# EAGLE design quadrant_tia (EAGLE 6.5.0)
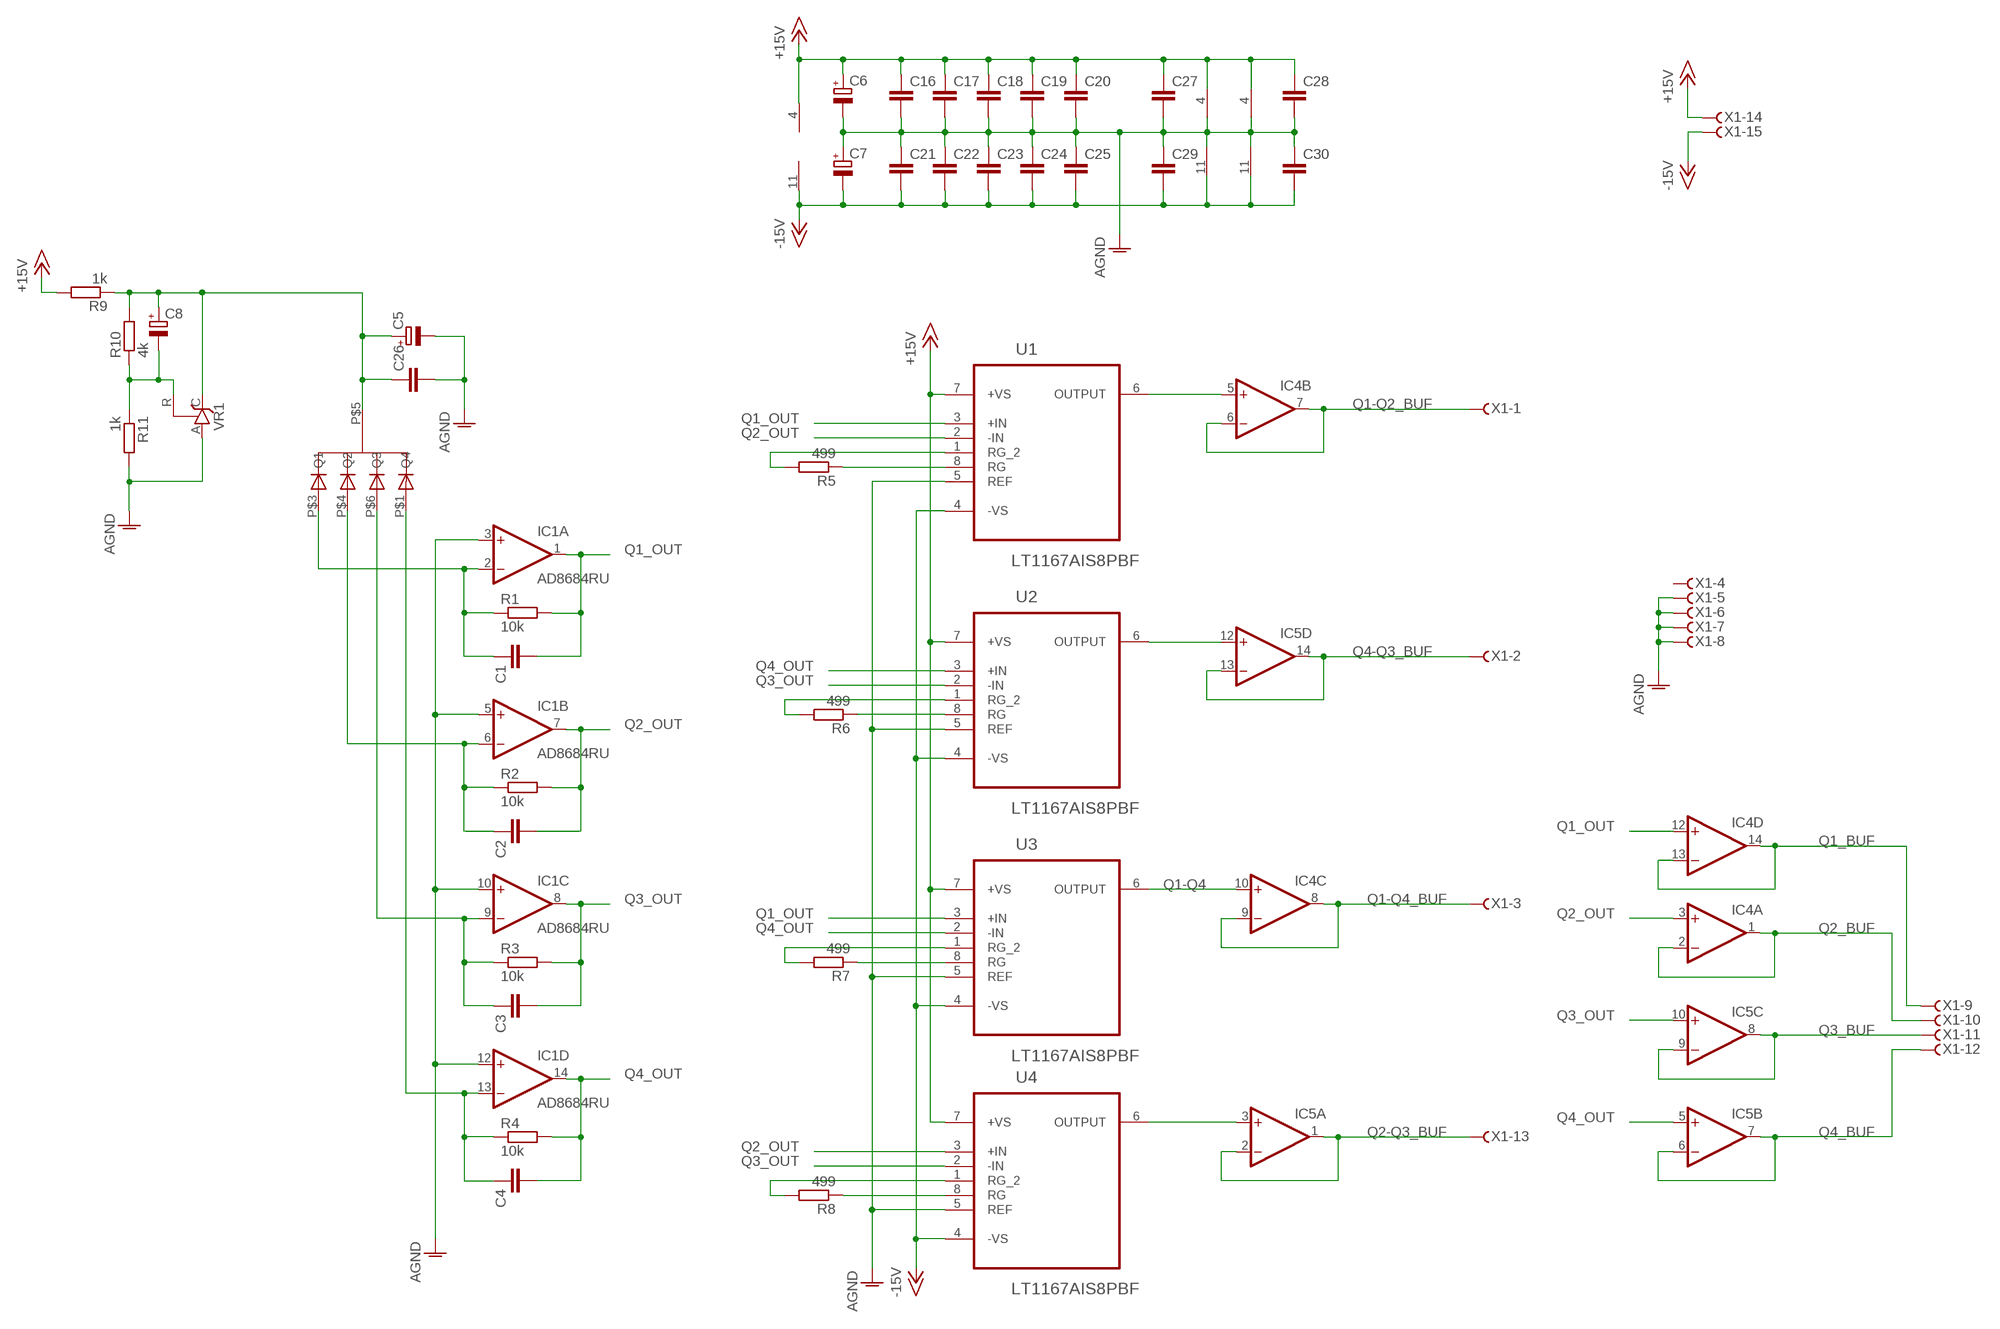
[diagram p0: schematic, sheet 1]

## Parts
C1  C-EUC0805K  [C0805K]
C2  C-EUC0805K  [C0805K]
C3  C-EUC0805K  [C0805K]
C4  C-EUC0805K  [C0805K]
C5  CPOL-EUE5-8.5  [E5-8,5]
C6  CPOL-EUE5-8.5  [E5-8,5]
C7  CPOL-EUE5-8.5  [E5-8,5]
C8  CPOL-EUE5-8.5  [E5-8,5]
C16  C-EUC0805K  [C0805K]
C17  C-EUC0805K  [C0805K]
C18  C-EUC0805K  [C0805K]
C19  C-EUC0805K  [C0805K]
C20  C-EUC0805K  [C0805K]
C21  C-EUC0805K  [C0805K]
C22  C-EUC0805K  [C0805K]
C23  C-EUC0805K  [C0805K]
C24  C-EUC0805K  [C0805K]
C25  C-EUC0805K  [C0805K]
C26  C-EUC0805K  [C0805K]
C27  C-EUC0805K  [C0805K]
C28  C-EUC0805K  [C0805K]
C29  C-EUC0805K  [C0805K]
C30  C-EUC0805K  [C0805K]
IC1  AD8684RU  [TSSOP14]
IC4  4AMP_P4+11D  [SO14]
IC5  4AMP_P4+11D  [SO14]
R1  10k  R-EU_M1206  [M1206]
R2  10k  R-EU_M1206  [M1206]
R3  10k  R-EU_M1206  [M1206]
R4  10k  R-EU_M1206  [M1206]
R5  499  R-EU_M1206  [M1206]
R6  499  R-EU_M1206  [M1206]
R7  499  R-EU_M1206  [M1206]
R8  499  R-EU_M1206  [M1206]
R9  1k  R-EU_R0805  [R0805]
R10  4k  R-EU_R0805  [R0805]
R11  1k  R-EU_R0805  [R0805]
U1  LT1167AIS8PBF  [SOIC127P600X175-8N]
U2  LT1167AIS8PBF  [SOIC127P600X175-8N]
U3  LT1167AIS8PBF  [SOIC127P600X175-8N]
U4  LT1167AIS8PBF  [SOIC127P600X175-8N]
U$1  QP50-6  [TO-HUGE]
VR1  TL431CLP  [TO92-CLP]
X1  F15HDHS  [HDF15H]

## Nets
+15V: C6.+ C16.1 C17.1 C18.1 C19.1 C20.1 C27.1 C28.1 IC1.4(P:V+) IC4.4(P:V+) IC5.4(P:V+) R9.2 U1.7(+VS) U2.7(+VS) U3.7(+VS) U4.7(+VS) X1.14
-15V: C7.- C21.2 C22.2 C23.2 C24.2 C25.2 C29.2 C30.2 IC1.11(P:V-) IC4.11(P:V-) IC5.11(P:V-) U1.4(-VS) U2.4(-VS) U3.4(-VS) U4.4(-VS) X1.15
AGND: C5.- C6.- C7.+ C16.2 C17.2 C18.2 C19.2 C20.2 C21.1 C22.1 C23.1 C24.1 C25.1 C26.2 C27.2 C28.2 C29.1 C30.1 IC1.3(A:+IN) IC1.5(B:+IN) IC1.10(C:+IN) IC1.12(D:+IN) R11.2 U1.5(REF) U2.5(REF) U3.5(REF) U4.5(REF) VR1.A X1.5 X1.6 X1.7 X1.8
N$1: C1.1 IC1.2(A:-IN) R1.1 U$1.P$3(Q1)
N$2: R7.1 U3.8(RG)
N$3: R7.2 U3.1(RG_2)
N$4: C2.1 IC1.6(B:-IN) R2.1 U$1.P$4(Q2)
N$5: R6.1 U2.8(RG)
N$6: C3.1 IC1.9(C:-IN) R3.1 U$1.P$6(Q3)
N$7: R6.2 U2.1(RG_2)
N$8: C4.1 IC1.13(D:-IN) R4.1 U$1.P$1(Q4)
N$9: R5.2 U1.1(RG_2)
N$10: R5.1 U1.8(RG)
N$11: R8.2 U4.1(RG_2)
N$12: R8.1 U4.8(RG)
N$13: IC4.5(B:+IN) U1.6(OUTPUT)
N$14: IC5.3(A:+IN) U4.6(OUTPUT)
N$15: IC5.12(D:+IN) U2.6(OUTPUT)
N$16: C5.+ C8.+ C26.1 R9.1 R10.2 U$1.P$5(C) VR1.C
N$17: C8.- R10.1 R11.1 VR1.R
Q1-Q2_BUF: IC4.6(B:-IN) IC4.7(B:OUT) X1.1
Q1-Q4: IC4.10(C:+IN) U3.6(OUTPUT)
Q1-Q4_BUF: IC4.8(C:OUT) IC4.9(C:-IN) X1.3
Q1_BUF: IC4.13(D:-IN) IC4.14(D:OUT) X1.9
Q1_OUT: C1.2 IC1.1(A:OUT) IC4.12(D:+IN) R1.2 U1.3(+IN) U3.3(+IN)
Q2-Q3_BUF: IC5.1(A:OUT) IC5.2(A:-IN) X1.13
Q2_BUF: IC4.1(A:OUT) IC4.2(A:-IN) X1.10
Q2_OUT: C2.2 IC1.7(B:OUT) IC4.3(A:+IN) R2.2 U1.2(-IN) U4.3(+IN)
Q3_BUF: IC5.8(C:OUT) IC5.9(C:-IN) X1.11
Q3_OUT: C3.2 IC1.8(C:OUT) IC5.10(C:+IN) R3.2 U2.2(-IN) U4.2(-IN)
Q4-Q3_BUF: IC5.13(D:-IN) IC5.14(D:OUT) X1.2
Q4_BUF: IC5.6(B:-IN) IC5.7(B:OUT) X1.12
Q4_OUT: C4.2 IC1.14(D:OUT) IC5.5(B:+IN) R4.2 U2.3(+IN) U3.2(-IN)
Unconnected: X1.4

## Library data of the parts
C1-C4 C16-C30 = resistor:C-EU: CAPACITOR, European symbol
C5-C8 = resistor:CPOL-EU: POLARIZED CAPACITOR, European symbol
IC1 = linear:AD8684: Quad Low Power, High Speed JFET Operational Amplifiers Source: http://www.analog.com/UploadedFiles/Data_Sheets/AD8682_8684.pdf
IC4 IC5 = linear:4AMP_P4+11: OP AMP
R1-R11 = resistor:R-EU_: RESISTOR, European symbol
U1-U4 = LT1167:LT1167AIS8PBF: Single Resistor Gain Programmable, Precision Instrumentation Amplifier; MPN: LT1167AIS8#PBF; OC_FARNELL: 1663385; OC_NEWARK: 57M2299; PACKAGE: SOIC-8; SUPPLIER: Linear Technology
U$1 = QP50-6:QP50-6
VR1 = v-reg:TL431CLP: VOLTAGE REGULATOR
X1 = con-subd:F15?S: SUB-D; OC_FARNELL: unknown; OC_NEWARK: unknown

## Board
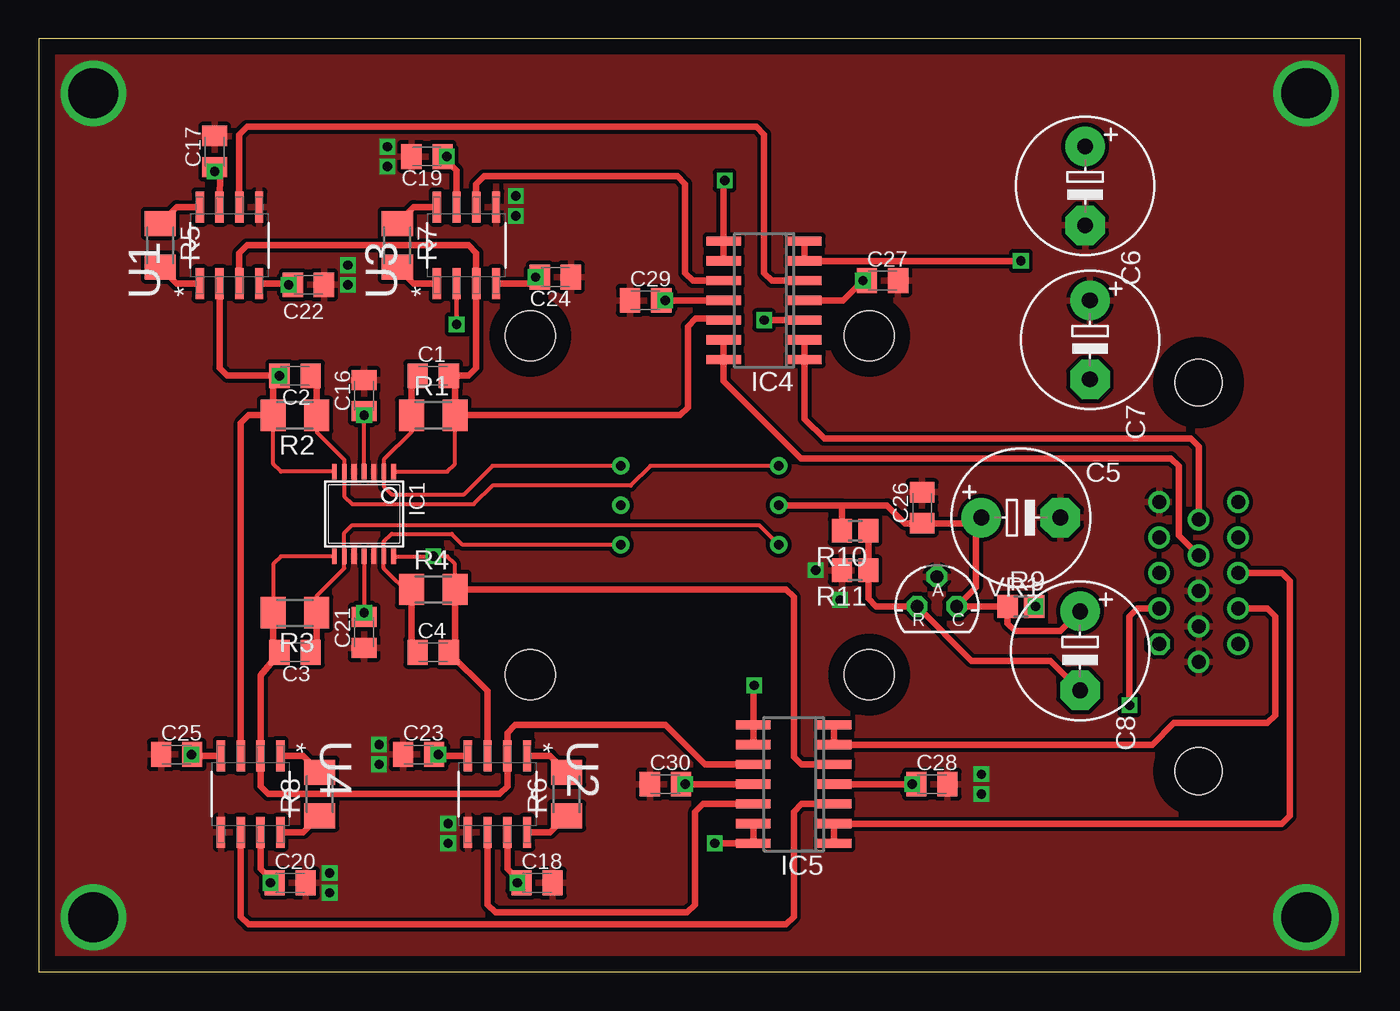
[diagram p1: board, top side]
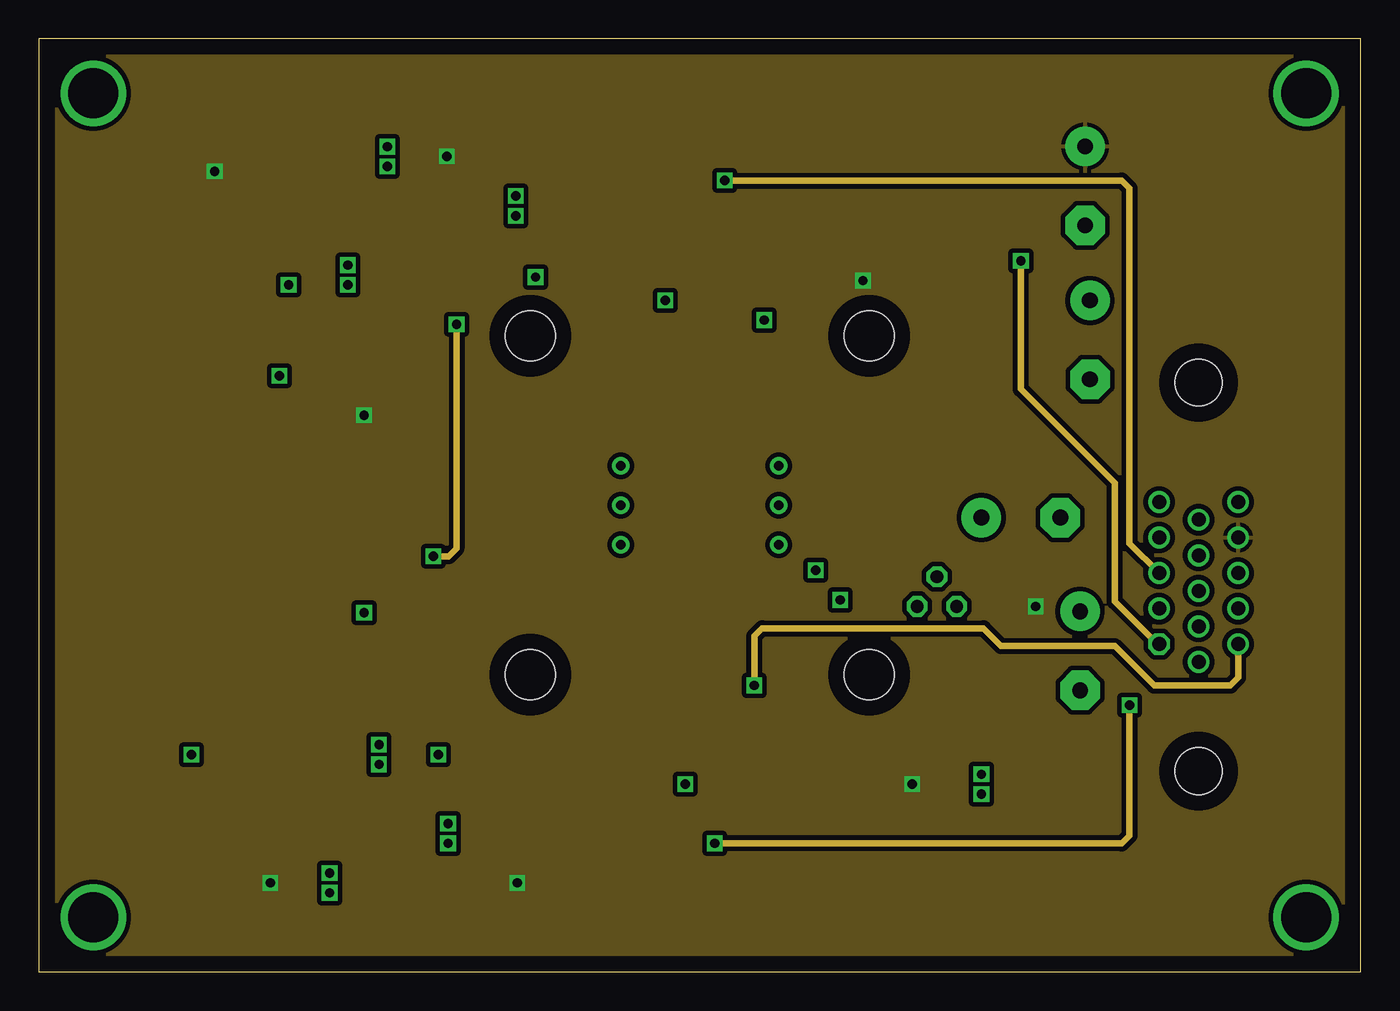
[diagram p2: board, inner layer Route2]
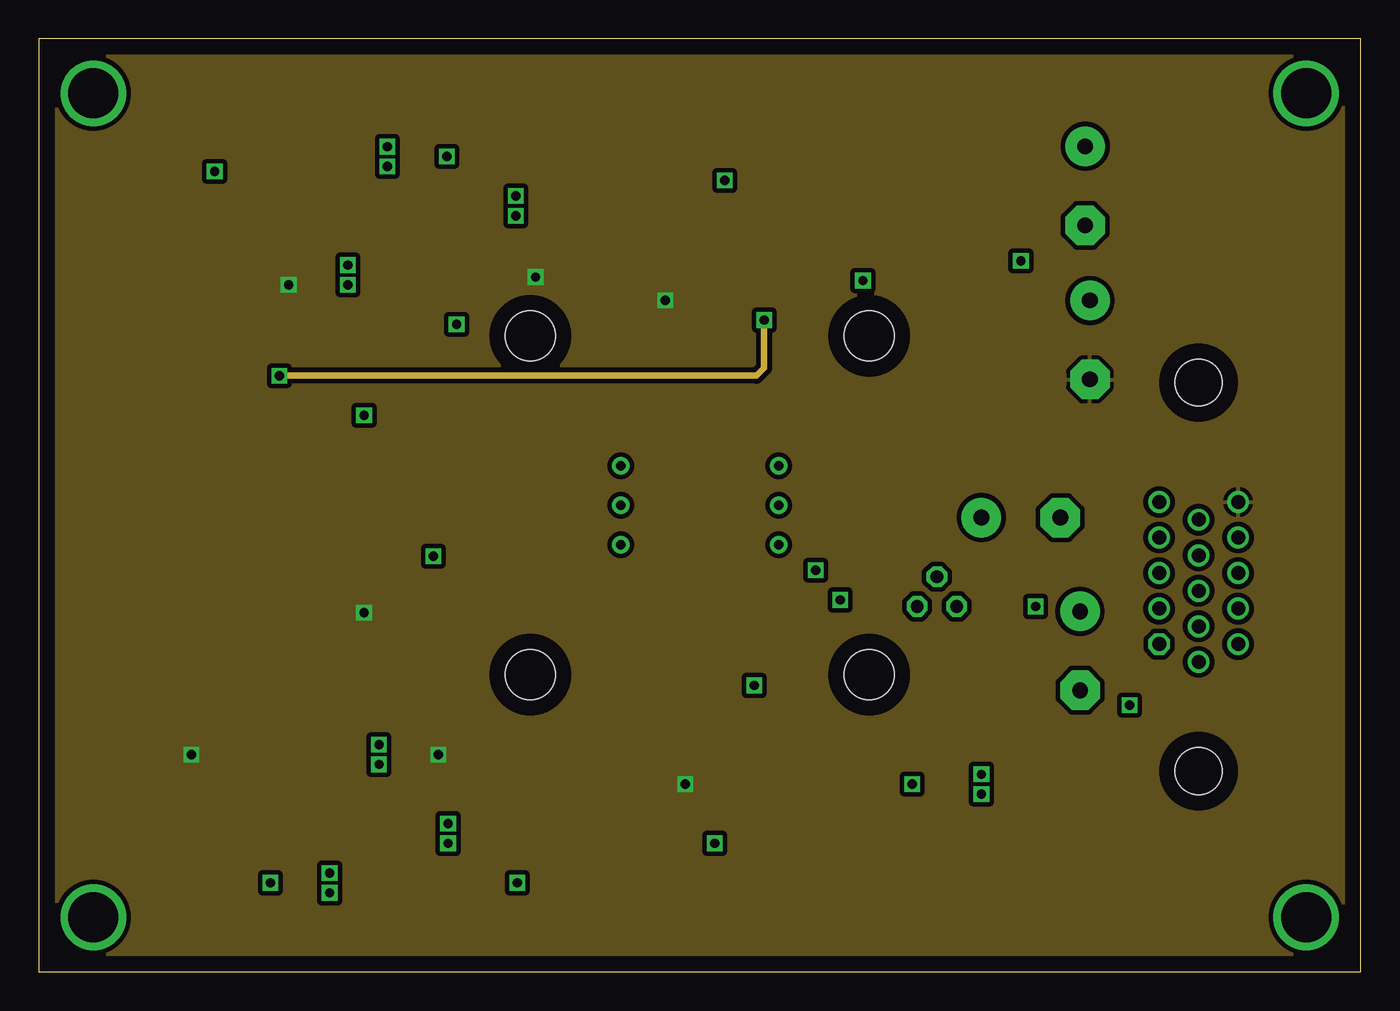
[diagram p3: board, inner layer Route3]
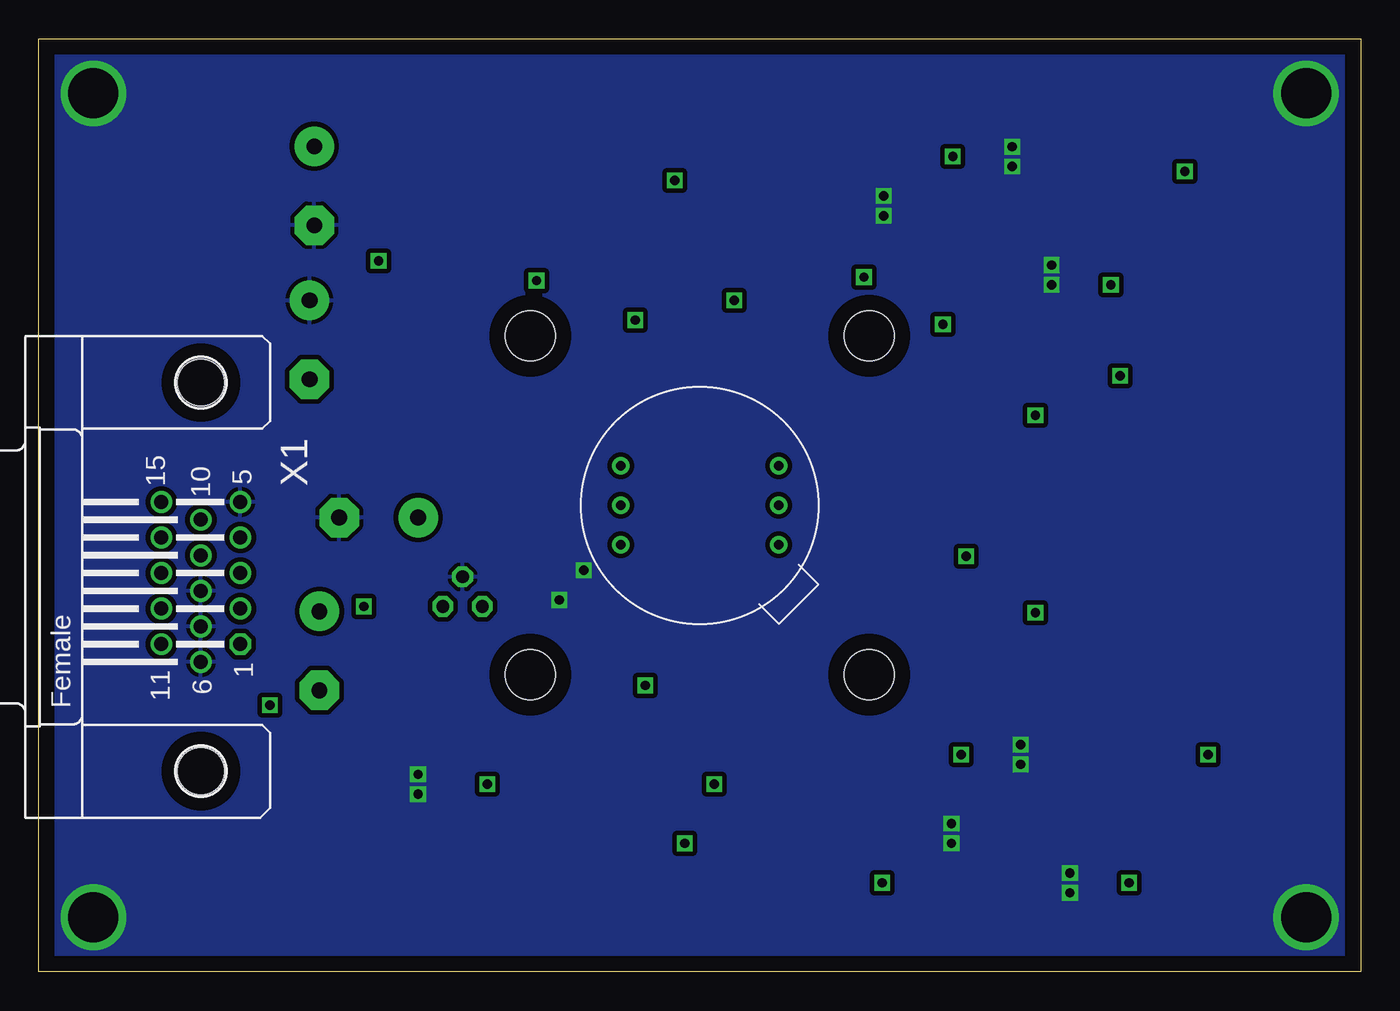
[diagram p4: board, bottom side, seen from below]

Size 85 x 60 mm. Coordinates in mm from the lower left corner, seen from the top.
Outline: 0,0 85,0 85,60 0,60 0,0
Copper layers (1*2*3*16): Top 0.035mm / dielectric 0.5mm / Route2 0.035mm / dielectric 0.5mm / Route3 0.035mm / dielectric 0.5mm / Bottom 0.035mm
Design rules "default *": minimum track width 10mil, minimum drill 24mil, track to track 8mil, track to pad 8mil, pad to pad 8mil, via to via 8mil, smd to smd 8mil, copper to edge 40mil, drill to drill 8mil, minimum pad ring 10mil, minimum via ring 8mil, stop-mask expansion 4mil, vias tented up to drill 0mil, thermal gap 10mil
Holes 3.2 mm at 53.4,40.9 31.6,40.9 31.6,19.1 53.4,19.1

### Footprints (pad centres in the part's own frame; a part is rotated, then mirrored left to right if it is on the bottom)
C0805K = smd 1.3 x 1.6: 1 -1,0; 2 1,0
E5-8,5 = drill 1.016 pad 2.54: + -2.54,0 | drill 1.016 pad 2.54 octagon: - 2.54,0
TSSOP14 = smd 0.305 x 0.991: 1 -1.905,-2.718; 2 -1.27,-2.718; 3 -0.635,-2.718; 4 0,-2.718; 5 0.635,-2.718; 6 1.27,-2.718; 7 1.905,-2.718; 8 1.905,2.718; 9 1.27,2.718; 10 0.635,2.718; 11 0,2.718; 12 -0.635,2.718; 13 -1.27,2.718; 14 -1.905,2.718
SO14 = smd 0.6 x 2.2: 1 -3.81,-2.6; 2 -2.54,-2.6; 3 -1.27,-2.6; 4 0,-2.6; 5 1.27,-2.6; 6 2.54,-2.6; 7 3.81,-2.6; 8 3.81,2.6; 9 2.54,2.6; 10 1.27,2.6; 11 0,2.6; 12 -1.27,2.6; 13 -2.54,2.6; 14 -3.81,2.6
M1206 = smd 1.6 x 2: 1 -1.4,0; 2 1.4,0
R0805 = smd 1.3 x 1.5: 1 -0.85,0; 2 0.85,0
SOIC127P600X175-8N = smd 1.981 x 0.533: 1 -2.464,1.905; 2 -2.464,0.635; 3 -2.464,-0.635; 4 -2.464,-1.905; 5 2.464,-1.905; 6 2.464,-0.635; 7 2.464,0.635; 8 2.464,1.905
TO-HUGE = drill 0.6: P$1 5.08,-2.54; P$2 5.08,0; P$3 5.08,2.54; P$4 -5.08,2.54; P$5 -5.08,0; P$6 -5.08,-2.54
TO92-CLP = drill 0.813 octagon: A 0,1.905; C 1.27,0; R -1.27,0
HDF15H = drill 0.9 octagon: 1 4.329,2.54 | drill 0.9: 2 2.043,2.54; 3 -0.243,2.54; 4 -2.529,2.54; 5 -4.815,2.54; 6 5.472,0; 7 3.186,0; 8 0.9,0; 9 -1.386,0; 10 -3.672,0; 11 4.329,-2.54; 12 2.043,-2.54; 13 -0.243,-2.54; 14 -2.529,-2.54; 15 -4.815,-2.54 | hole 3: -12.5,0; 12.5,0

### Placement (x,y rotation side)
C1  25.36,38.33 0 top
C2  16.47,38.33 180 top
C3  16.47,20.55 180 top
C4  25.36,20.55 0 top
C5  63.15,29.21 0 top
C6  67.28,50.55 270 top
C7  67.59,40.64 270 top
C8  66.96,20.64 270 top
C16  20.91,37.06 90 top
C17  11.3,52.75 90 top
C18  32.03,5.71 0 top
C19  24.95,52.44 180 top
C20  16.16,5.71 0 top
C21  20.91,21.82 90 top
C22  17.34,44.18 180 top
C23  24.41,13.97 0 top
C24  33.21,44.68 180 top
C25  8.86,13.97 0 top
C26  56.8,29.84 90 top
C27  54.26,44.45 0 top
C28  57.44,12.07 0 top
C29  39.02,43.18 0 top
C30  40.29,12.07 0 top
IC1  20.91,29.44 180 top
IC4  46.64,43.18 90 top
IC5  48.55,12.07 90 top
R1  25.36,35.79 0 top
R2  16.47,35.79 180 top
R3  16.47,23.09 180 top
R4  25.36,24.59 0 top
R5  7.81,46.72 270 top
R6  33.94,11.43 90 top
R7  23.05,46.72 270 top
R8  18.07,11.43 90 top
R9  63.15,23.5 0 top
R10  52.49,28.36 180 top
R11  52.49,25.82 180 top
U1  12.25,46.72 90 top
U2  29.49,11.43 270 top
U3  27.49,46.72 90 top
U4  13.62,11.43 270 top
U$1  42.5,30 0 bottom
VR1  57.75,23.5 0 top
X1  74.58,25.4 270 bottom

### Tracks (layer width: path | path; a pad name or v marks a point on that pad's centre or on a via)
+15V  (via drill 0.6)
  Top 0.254: IC1.4 v20.91,35.79 C16.1 | v30.77,5.71 C18.1 | C20.1 v14.89,5.71 | C17.1 v11.3,51.48
  Top 0.406: C28.1 v56.16,12.07 IC5.4 | U4.7 14.25,6.62 C20.1 | U3.7 26.86,51.53 C19.1 v26.23,52.44 | U2.7 30.13,6.62 C18.1 | U1.7 11.67,51.8 C17.1 | C27.1 v52.99,44.45 51.72,43.18 IC4.4 | R9.2 v64.1,23.5
  pour Route2 (isolate 0.305): 1,0 86.01,0 86.01,60.25 1,60.25
-15V  (via drill 0.6)
  Top 0.254: IC1.11 v20.91,23.09 C21.2 | C25.2 v9.81,13.97 | v40.29,43.18 39.66,43.18 | v25.68,13.97 C23.2 | v31.94,44.68 C24.2 | 16.26,44.26 16.07,44.26 v16.07,44.18
  Top 0.406: v41.56,12.07 C30.2 | IC4.11 v40.29,43.18 C29.2 | U1.4 16.26,44.26 C22.2 | U2.4 25.49,13.89 C23.2 | 31.75,44.76 C24.2 | U4.4 9.62,13.89 C25.2 | IC5.11 v41.56,12.07 | v41.56,12.07 40.92,12.07 | U3.4 31.52,44.26 arc90 v31.94,44.68
  pour Route3 (isolate 0.305): 1,0 86.01,0 86.01,60.25 1,60.25
AGND  (via drill 0.6, 3.2)
  other vias: 19.88,44.18 30.67,49.89 30.67,48.62 22.41,53.07 22.41,51.8 19.88,45.45 18.7,6.35 18.7,5.08 26.32,9.52 26.32,8.25 21.88,14.61 21.88,13.34 60.61,12.7 60.61,11.43 49.95,25.82 51.54,23.91 81.5,3.5 3.5,56.5 81.5,56.5 3.5,3.5
  pour Bottom (isolate 0.305): 1,60.25 86.01,60.25 86.01,0 1,0
  pour Top (isolate 0.254): 1,60.25 86.01,60.25 86.01,0 1,0
N$1
  Top 0.254: R1.1 23.96,34.71 22.18,32.93 IC1.2 22.18,31.21 22.68,30.71 27.34,30.71 29.16,32.54 U$1.P$3
  Top 0.406: R1.1 23.96,37.93 C1.1
N$2
  Top 0.406: R7.1 24.11,49.18 U3.8
N$3
  Top 0.406: R7.2 24.11,44.26 U3.1
N$4
  Top 0.254: R2.1 17.87,34.71 19.64,32.93 IC1.6 19.64,30.57 20.14,30.07 27.97,30.07 29.16,31.27 38.05,31.27 39.33,32.54 U$1.P$4
  Top 0.406: R2.1 17.87,37.93 C2.1
N$5
  Top 0.406: R6.1 32.88,8.97 U2.8
N$6
  Top 0.254: R3.1 17.87,24.17 19.64,25.95 IC1.9 19.64,28.23 20.14,28.73 46.31,28.73 U$1.P$6
  Top 0.406: R3.1 17.87,20.95 C3.1
N$7
  Top 0.406: R6.2 32.88,13.89 U2.1
N$8
  Top 0.254: R4.1 23.96,24.17 22.18,25.95 IC1.13 22.18,27.67 22.68,28.17 26.55,28.17 27.26,27.46 U$1.P$1
  Top 0.406: R4.1 23.96,20.95 C4.1
N$9
  Top 0.406: R5.2 8.87,44.26 U1.1
N$10
  Top 0.406: R5.1 8.87,49.18 U1.8
N$11
  Top 0.406: R8.2 17,13.89 U4.1
N$12
  Top 0.406: R8.1 17,8.97 U4.8
N$13
  Top 0.406: U1.6 12.89,53.84 13.39,54.34 46.14,54.34 46.64,53.84 46.64,44.95 47.14,44.45 IC4.5
N$14
  Top 0.406: U4.6 12.98,3.54 13.48,3.04 48.05,3.04 48.55,3.54 48.55,10.3 49.05,10.8 IC5.3
N$15
  Top 0.406: U2.6 28.86,4.31 29.36,3.81 41.7,3.81 42.2,4.31 42.2,10.3 42.7,10.8 IC5.12
N$16
  Top 0.406: 60.25,28.84 C26.1 55.7,28.84 54.55,30 51.64,30 | 60.25,28.84 C5.+ | 60.25,28.84 60.25,24.72 VR1.C R9.1 62.3,22.41 62.8,21.91 65.69,21.91 C8.+ | 51.64,30 U$1.P$5 | R10.2 51.64,30
N$17
  Top 0.406: C8.- 65.06,20 59.98,20 VR1.R 53.84,23.5 53.34,24 R11.1 R10.1
Q1-Q2_BUF  (via drill 0.6)
  Top 0.406: IC4.7 IC4.6 v63.15,45.72
  Route2 0.406: X1.1 71.92,21.07 69.18,23.81 69.18,31.43 63.15,37.47 v63.15,45.72
Q1-Q4
  Top 0.406: U3.6 28.13,50.66 28.63,51.16 41.06,51.16 41.56,50.66 41.56,44.95 42.06,44.45 IC4.10
Q1-Q4_BUF  (via drill 0.6)
  Top 0.406: IC4.8 IC4.9 44.04,50.84 v44.1,50.89
  Route2 0.406: v44.1,50.89 69.64,50.89 70.14,50.39 70.14,27.55 X1.3
Q1_BUF
  Top 0.406: IC4.13 IC4.14 44.04,37.98 49,33.02 72.81,33.02 73.31,32.52 73.31,28.06 X1.9
Q1_OUT
  Top 0.254: IC1.1 26.26,32.16 26.76,32.66 R1.2
  Top 0.406: U1.3 12.89,46.22 13.39,46.72 27.63,46.72 28.13,46.22 U3.3 28.13,38.83 27.63,38.33 C1.2 26.76,37.93 R1.2 41.23,35.79 41.73,36.29 41.73,41.5 42.23,42 44.04,42 IC4.12
Q2-Q3_BUF
  Top 0.406: IC5.1 IC5.2 79.93,9.52 80.43,10.02 80.43,25.14 79.93,25.64 X1.13
Q2_BUF
  Top 0.406: IC4.2 IC4.1 49.24,35.56 50.51,34.29 50.76,34.29 74.08,34.29 74.58,33.79 X1.10
Q2_OUT  (via drill 0.6)
  Top 0.254: IC1.7 15.57,32.16 15.07,32.66 R2.2
  Top 0.406: U1.2 11.62,38.83 12.12,38.33 C2.2 15.07,37.93 R2.2 13.48,35.79 12.98,35.29 U4.3 | IC4.3 v46.64,41.91
  Route3 0.406: v46.64,41.91 46.64,38.83 46.14,38.33 C2.2
  other vias: 15.47,38.33
Q3_BUF  (via drill 0.6)
  Top 0.406: IC5.9 IC5.8 45.95,18.41 v46.01,18.41
  Route2 0.406: v46.01,18.41 46.01,21.59 46.51,22.09 60.75,22.09 61.88,20.95 69.18,20.95 71.72,18.41 76.62,18.41 77.12,18.91 X1.11
Q3_OUT
  Top 0.254: IC1.8 15.57,26.72 15.07,26.22 R3.2
  Top 0.406: R3.2 15.07,20.95 C3.2 14.25,19.05 U4.2 14.25,11.93 14.75,11.43 29.63,11.43 30.13,11.93 U2.2 30.13,15.38 30.63,15.88 40.29,15.88 42.83,13.34 IC5.10
Q4-Q3_BUF  (via drill 0.6)
  Top 0.406: IC5.13 IC5.14 v43.47,8.25 | X1.2 70.64,23.36 70.14,22.86 v70.14,17.14
  Route2 0.406: v70.14,17.14 70.14,8.75 69.64,8.25 v43.47,8.25
Q4_BUF
  Top 0.406: IC5.7 IC5.6 71.61,14.61 73,16 79,16 79.5,16.5 79.5,22.86 79,23.36 X1.12
Q4_OUT  (via drill 0.6)
  Top 0.254: IC1.14 v25.36,26.72 26.26,26.72 26.76,26.22 R4.2
  Top 0.305: U3.2 v26.86,41.64
  Top 0.406: IC5.5 49.05,13.34 48.55,13.84 48.55,24.09 48.05,24.59 R4.2 26.76,20.95 C4.2 28.86,18.05 U2.3
  Route2 0.406: v26.86,41.64 26.86,27.22 26.36,26.72 v25.36,26.72

### Text on the board
tDocu: (C) M. Helsen 2013, UGent